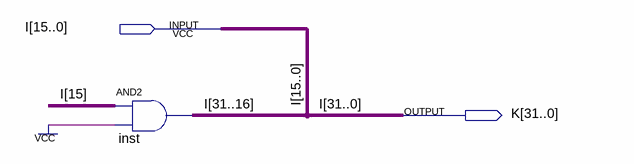
[diagram p0: schematic sheet]
// Quartus schematic Sign-extend.bdf as structural Verilog: 1 symbols, 2 pins
module \Sign-extend  (
  input  [15:0] I,
  output [31:0] K
);

  assign K[31:16] = {16{I[15]}} & {16{1'b1}};  // AND2 inst, 16 bits wide

  assign K[15:0] = I;

  // Other names for the same wires on the sheet: I[31:16] = K[31:16]
endmodule
